# EAGLE schematic SUPERHOOP (EAGLE 6.5.0)
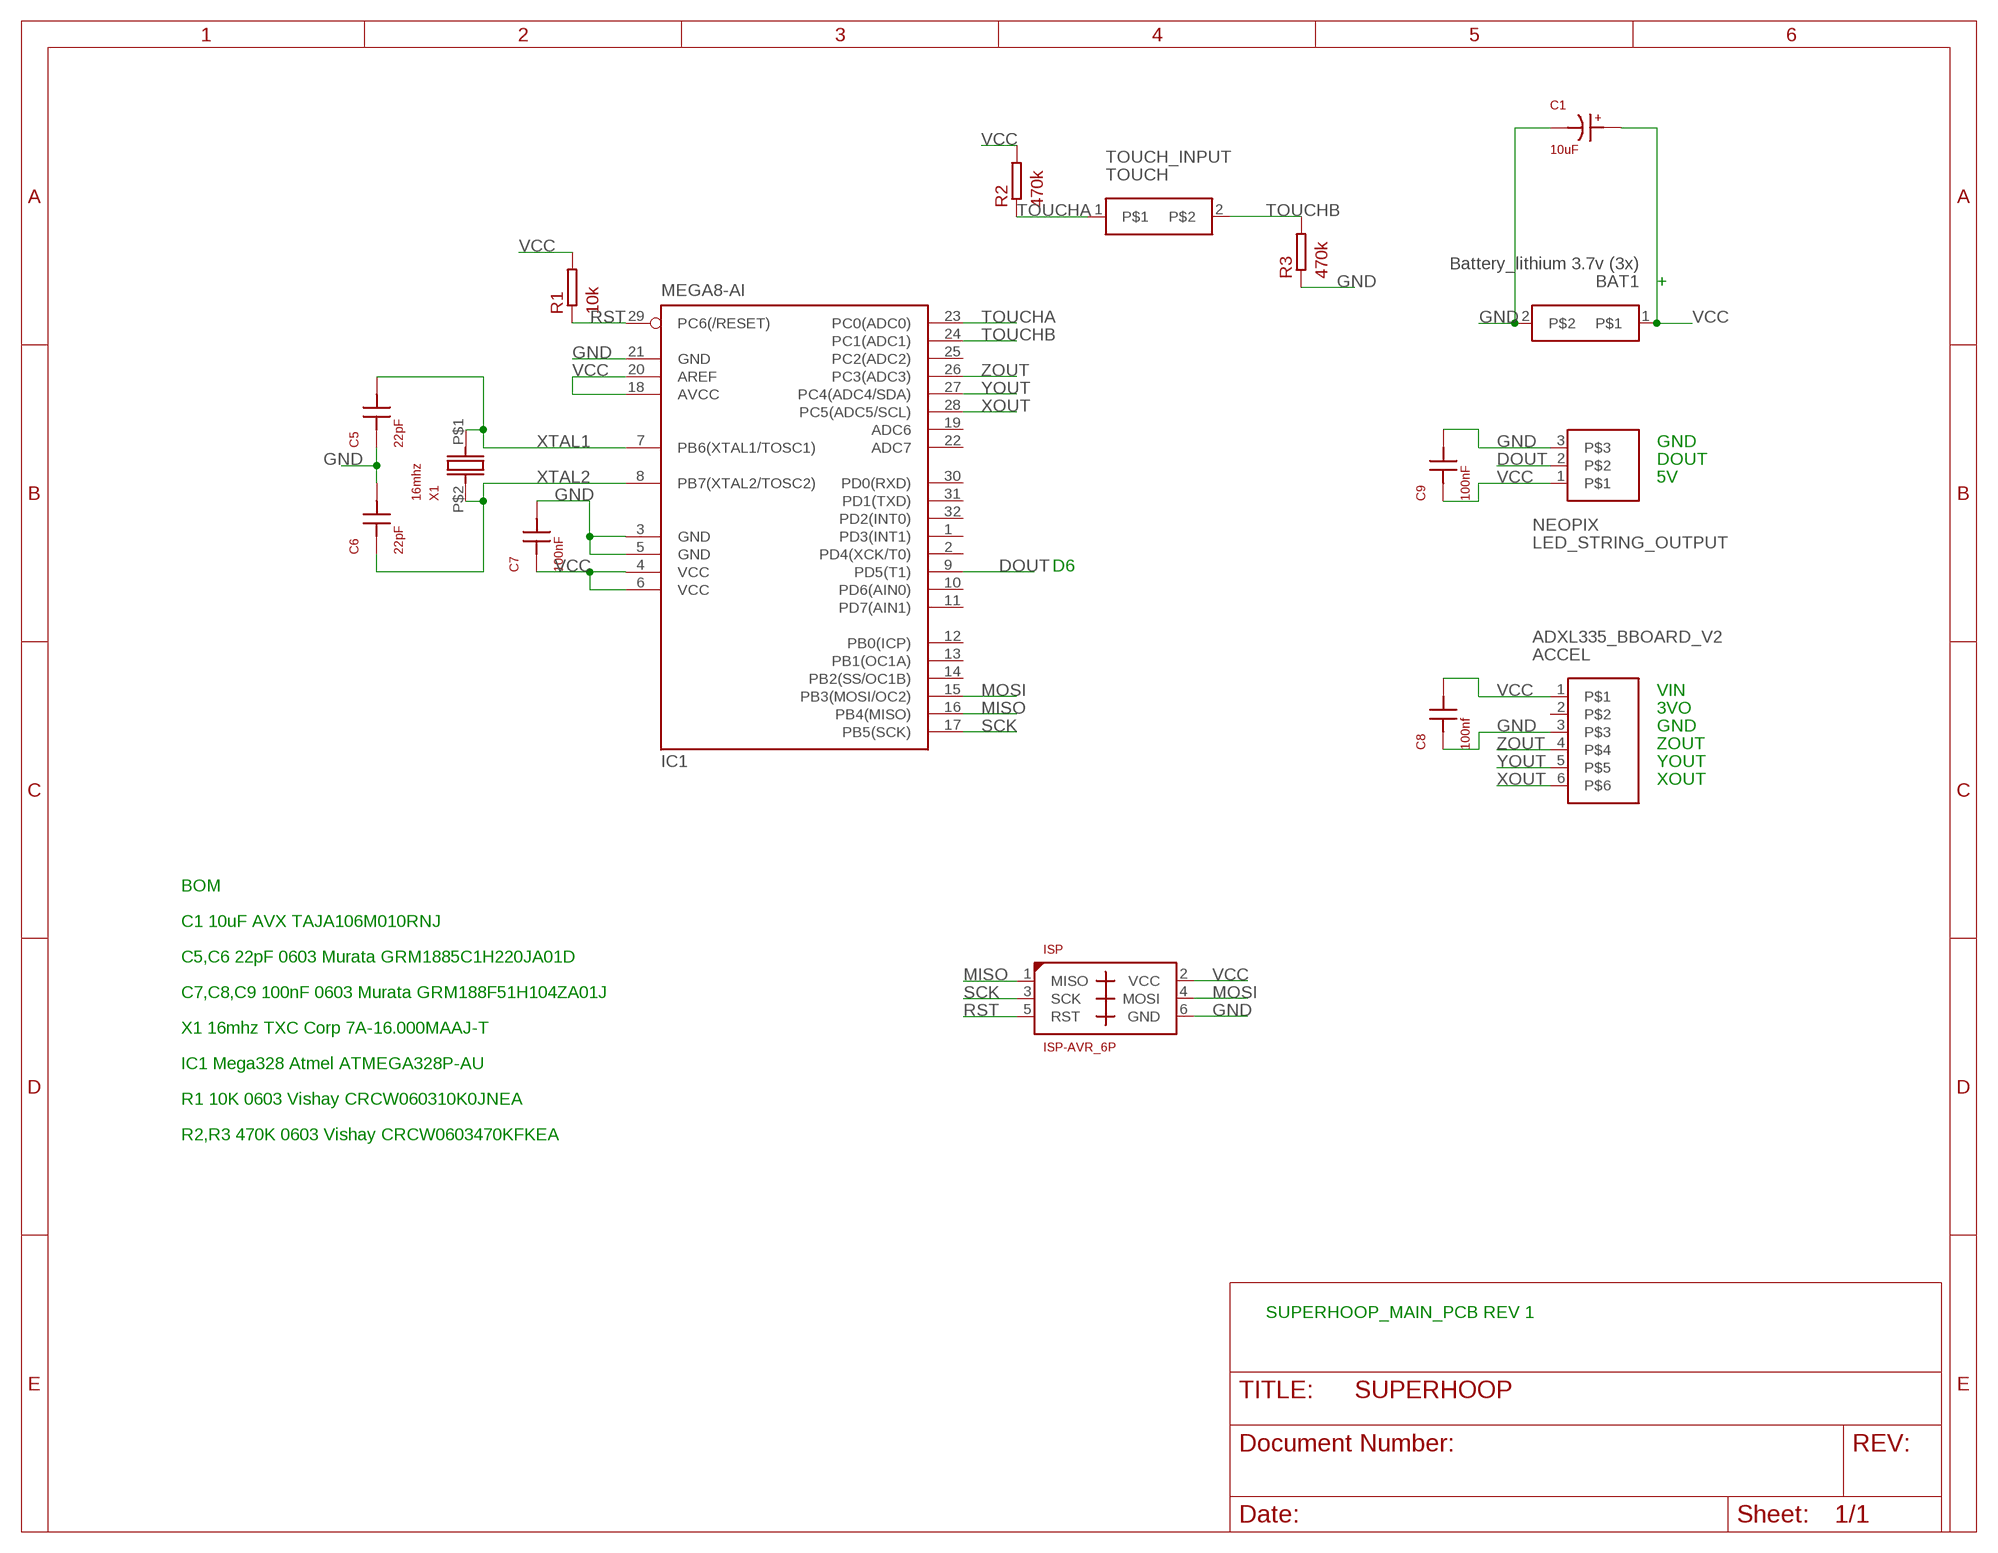
[diagram p0: schematic, sheet 1]

## Parts
ACCEL  ADXL335_BBOARD_V2  HEADER_6X1_2.54  [HEADER_6X1_2.54]
BAT1  Battery_lithium 3.7v (3x)  HEADER_2X1_2.54  [HEADER_2X1_2.54]
C1  10uF  CAP_POL_SMD_1206  [CAP_POL_1206]
C5  22pF  CAP_NP_0603  [SMD_0603]
C6  22pF  CAP_NP_0603  [SMD_0603]
C7  100nF  CAP_NP_0603  [SMD_0603]
C8  100nf  CAP_NP_0603  [SMD_0603]
C9  100nF  CAP_NP_0603  [SMD_0603]
IC1  MEGA8-AI  [TQFP32-08]
ISP  ISP-AVR_6P  [HEADER_3X2_2.54]
NEOPIX  LED_STRING_OUTPUT  HEADER_3X1  [HEADER_3X1_2.54]
R1  10k  RESISTOR_0603  [SMD_0603]
R2  470k  RESISTOR_0603  [SMD_0603]
R3  470k  RESISTOR_0603  [SMD_0603]
TOUCH  TOUCH_INPUT  HEADER_2X1_2.54  [HEADER_2X1_2.54]
X1  16mhz  CRYSTAL_SMD_5.0X3.2  [CRYSTAL_5.0X3.2]

## Nets
DOUT: IC1.9(PD5(T1)) NEOPIX.2
GND: ACCEL.3 BAT1.2 C1.N C5.P$1 C6.P$2 C7.P$2 C8.P$1 C9.P$2 IC1.3(GND) IC1.5(GND) IC1.21(GND) ISP.6(GND) NEOPIX.3 R3.P$1
MISO: IC1.16(PB4(MISO)) ISP.1(MISO)
MOSI: IC1.15(PB3(MOSI/OC2)) ISP.4(MOSI)
RST: IC1.29(PC6(/RESET)) ISP.5(RST) R1.P$1
SCK: IC1.17(PB5(SCK)) ISP.3(SCK)
TOUCHA: IC1.23(PC0(ADC0)) R2.P$1 TOUCH.1
TOUCHB: IC1.24(PC1(ADC1)) R3.P$2 TOUCH.2
VCC: ACCEL.1 BAT1.1 C1.P C7.P$1 C8.P$2 C9.P$1 IC1.4(VCC) IC1.6(VCC) IC1.18(AVCC) IC1.20(AREF) ISP.2(VCC) NEOPIX.1 R1.P$2 R2.P$2
XOUT: ACCEL.6 IC1.28(PC5(ADC5/SCL))
XTAL1: C5.P$2 IC1.7(PB6(XTAL1/TOSC1)) X1.P$1
XTAL2: C6.P$1 IC1.8(PB7(XTAL2/TOSC2)) X1.P$2
YOUT: ACCEL.5 IC1.27(PC4(ADC4/SDA))
ZOUT: ACCEL.4 IC1.26(PC3(ADC3))
Unconnected: ACCEL.2 IC1.1(PD3(INT1)) IC1.2(PD4(XCK/T0)) IC1.10(PD6(AIN0)) IC1.11(PD7(AIN1)) IC1.12(PB0(ICP)) IC1.13(PB1(OC1A)) IC1.14(PB2(SS/OC1B)) IC1.19(ADC6) IC1.22(ADC7) IC1.25(PC2(ADC2)) IC1.30(PD0(RXD)) IC1.31(PD1(TXD)) IC1.32(PD2(INT0))

## Notes on the sheet
- +
- GND
- DOUT
- 5V
- D6
- VIN
- 3VO
- GND
- ZOUT
- YOUT
- XOUT
- BOM
- C1 10uF AVX TAJA106M010RNJ
- C5,C6 22pF 0603 Murata GRM1885C1H220JA01D
- C7,C8,C9 100nF 0603 Murata GRM188F51H104ZA01J
- X1 16mhz TXC Corp 7A-16.000MAAJ-T
- IC1 Mega328 Atmel ATMEGA328P-AU
- R1 10K 0603 Vishay CRCW060310K0JNEA
- R2,R3 470K 0603 Vishay CRCW0603470KFKEA
- SUPERHOOP_MAIN_PCB REV 1

## Library data of the parts
ACCEL = daneagle_db:HEADER_6X1
BAT1 TOUCH = daneagle_db:HEADER_2X1
C1 = daneagle_db:CAP_POL
C5-C9 = daneagle_db:CAP_NP
IC1 = atmel:MEGA8: MICROCONTROLLER 8 Kbytes FLASH, 1 kbytes SRAM, 512 bytes EEPROM, USART, 6-channel 10 bit ADC, 2-channel 8 bit ADC Pin compatible with Atmega48, ATMega88, ATMega168 Source: avr.lbr; MPN: ATMEGA8-16AU; OC_FARNELL: 9171371; OC_NEWARK: 73M8863
ISP = daneagle_db:ISP-AVR
NEOPIX = daneagle_db:HEADER_3X1
R1-R3 = daneagle_db:RESISTOR
X1 = daneagle_db:CRYSTAL_SMD